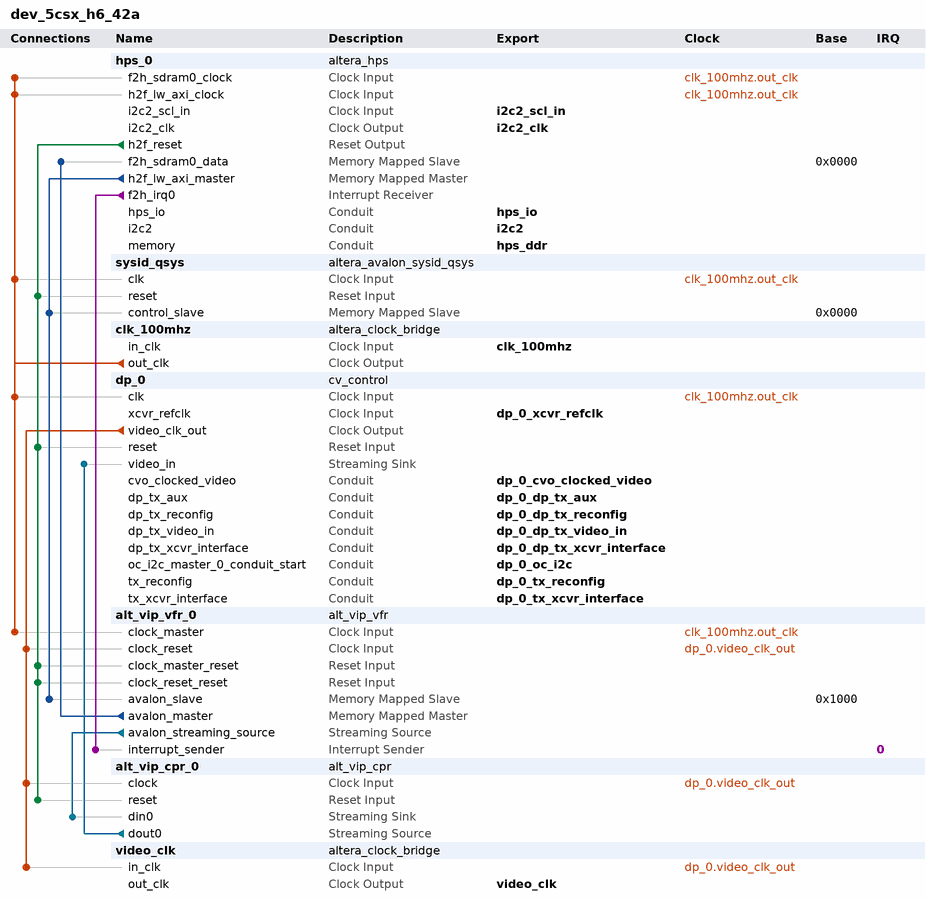
[diagram p0: system contents]
# Platform Designer (Qsys) system dev_5csx_h6_42a, Cyclone V 5CSXFC6C6U23C7
# Parameters at their usual value, and those the tool derives, are not listed.
package require -exact qsys 16.0
create_system dev_5csx_h6_42a
set_project_property DEVICE_FAMILY {Cyclone V}
set_project_property DEVICE 5CSXFC6C6U23C7

add_instance hps_0 altera_hps 16.0
set_instance_parameter_value hps_0 CAN0_Mode CAN
set_instance_parameter_value hps_0 CAN0_PinMuxing {HPS I/O Set 0}
set_instance_parameter_value hps_0 CAN1_Mode CAN
set_instance_parameter_value hps_0 CAN1_PinMuxing {HPS I/O Set 1}
set_instance_parameter_value hps_0 EMAC1_Mode RGMII
set_instance_parameter_value hps_0 EMAC1_PinMuxing {HPS I/O Set 0}
set_instance_parameter_value hps_0 F2SCLK_COLDRST_Enable false
set_instance_parameter_value hps_0 F2SCLK_DBGRST_Enable false
set_instance_parameter_value hps_0 F2SCLK_WARMRST_Enable false
set_instance_parameter_value hps_0 F2SDRAM_Type {Avalon-MM Read-Only}
set_instance_parameter_value hps_0 F2SDRAM_Width 256
set_instance_parameter_value hps_0 F2SINTERRUPT_Enable true
set_instance_parameter_value hps_0 F2S_Width 0
set_instance_parameter_value hps_0 FPGA_PERIPHERAL_OUTPUT_CLOCK_FREQ_EMAC0_GTX_CLK 100
set_instance_parameter_value hps_0 FPGA_PERIPHERAL_OUTPUT_CLOCK_FREQ_EMAC0_MD_CLK 100.0
set_instance_parameter_value hps_0 FPGA_PERIPHERAL_OUTPUT_CLOCK_FREQ_EMAC1_GTX_CLK 100
set_instance_parameter_value hps_0 FPGA_PERIPHERAL_OUTPUT_CLOCK_FREQ_EMAC1_MD_CLK 100.0
set_instance_parameter_value hps_0 HPS_PROTOCOL DDR3
set_instance_parameter_value hps_0 I2C0_Mode I2C
set_instance_parameter_value hps_0 I2C0_PinMuxing {HPS I/O Set 1}
set_instance_parameter_value hps_0 I2C1_Mode I2C
set_instance_parameter_value hps_0 I2C1_PinMuxing {HPS I/O Set 0}
set_instance_parameter_value hps_0 I2C2_Mode Full
set_instance_parameter_value hps_0 I2C2_PinMuxing FPGA
set_instance_parameter_value hps_0 LWH2F_Enable true
set_instance_parameter_value hps_0 MEM_BANKADDR_WIDTH 3
set_instance_parameter_value hps_0 MEM_CLK_FREQ 400.0
set_instance_parameter_value hps_0 MEM_COL_ADDR_WIDTH 10
set_instance_parameter_value hps_0 MEM_DQ_WIDTH 40
set_instance_parameter_value hps_0 MEM_DRV_STR RZQ/7
set_instance_parameter_value hps_0 MEM_ROW_ADDR_WIDTH 15
set_instance_parameter_value hps_0 MEM_RTT_NOM RZQ/4
set_instance_parameter_value hps_0 MEM_RTT_WR {Dynamic ODT off}
set_instance_parameter_value hps_0 MEM_TCL 7
set_instance_parameter_value hps_0 MEM_TFAW_NS 30.0
set_instance_parameter_value hps_0 MEM_TRAS_NS 35.0
set_instance_parameter_value hps_0 MEM_TRCD_NS 13.75
set_instance_parameter_value hps_0 MEM_TRFC_NS 260.0
set_instance_parameter_value hps_0 MEM_TRP_NS 13.75
set_instance_parameter_value hps_0 MEM_TRRD_NS 10.0
set_instance_parameter_value hps_0 MEM_TRTP_NS 10.0
set_instance_parameter_value hps_0 MEM_VENDOR JEDEC
set_instance_parameter_value hps_0 MEM_VOLTAGE {1.35V DDR3L}
set_instance_parameter_value hps_0 MEM_WTCL 6
set_instance_parameter_value hps_0 QSPI_Mode {2 SS}
set_instance_parameter_value hps_0 QSPI_PinMuxing {HPS I/O Set 1}
set_instance_parameter_value hps_0 REF_CLK_FREQ 25.0
set_instance_parameter_value hps_0 S2FCLK_USER2CLK 1
set_instance_parameter_value hps_0 S2F_Width 0
set_instance_parameter_value hps_0 SDIO_Mode {4-bit Data}
set_instance_parameter_value hps_0 SDIO_PinMuxing {HPS I/O Set 0}
set_instance_parameter_value hps_0 SPIM1_Mode N/A
set_instance_parameter_value hps_0 SPIM1_PinMuxing Unused
set_instance_parameter_value hps_0 STM_Enable false
set_instance_parameter_value hps_0 TIMING_BOARD_AC_SKEW 0.0
set_instance_parameter_value hps_0 TIMING_BOARD_AC_TO_CK_SKEW 0.0
set_instance_parameter_value hps_0 TIMING_BOARD_DQ_TO_DQS_SKEW 0.0
set_instance_parameter_value hps_0 TIMING_BOARD_MAX_CK_DELAY 0.6
set_instance_parameter_value hps_0 TIMING_BOARD_MAX_DQS_DELAY 0.2
set_instance_parameter_value hps_0 TIMING_BOARD_SKEW_BETWEEN_DQS 0.01
set_instance_parameter_value hps_0 TIMING_BOARD_SKEW_CKDQS_DIMM_MAX 0.215
set_instance_parameter_value hps_0 TIMING_BOARD_SKEW_CKDQS_DIMM_MIN 0.092
set_instance_parameter_value hps_0 TIMING_BOARD_SKEW_WITHIN_DQS 0.0
set_instance_parameter_value hps_0 TIMING_TDH 45
set_instance_parameter_value hps_0 TIMING_TDQSCK 225
set_instance_parameter_value hps_0 TIMING_TDQSQ 100
set_instance_parameter_value hps_0 TIMING_TDQSS 0.27
set_instance_parameter_value hps_0 TIMING_TDS 10
set_instance_parameter_value hps_0 TIMING_TDSH 0.18
set_instance_parameter_value hps_0 TIMING_TDSS 0.18
set_instance_parameter_value hps_0 TIMING_TIH 120
set_instance_parameter_value hps_0 TIMING_TIS 170
set_instance_parameter_value hps_0 TIMING_TQSH 0.4
set_instance_parameter_value hps_0 UART0_Mode {No Flow Control}
set_instance_parameter_value hps_0 UART0_PinMuxing {HPS I/O Set 2}
set_instance_parameter_value hps_0 USB1_Mode SDR
set_instance_parameter_value hps_0 USB1_PinMuxing {HPS I/O Set 0}
set_instance_parameter_value hps_0 desired_cfg_clk_mhz 100.0
set_instance_parameter_value hps_0 desired_qspi_clk_mhz 400.0

add_instance sysid_qsys altera_avalon_sysid_qsys 16.0
set_instance_parameter_value sysid_qsys id 1

add_instance clk_100mhz altera_clock_bridge 16.0
set_instance_parameter_value clk_100mhz DERIVED_CLOCK_RATE 0
set_instance_parameter_value clk_100mhz EXPLICIT_CLOCK_RATE 100000000

add_instance dp_0 cv_control 1.0

add_instance alt_vip_vfr_0 alt_vip_vfr 14.0
set_instance_parameter_value alt_vip_vfr_0 MAX_IMAGE_HEIGHT 1080
set_instance_parameter_value alt_vip_vfr_0 MAX_IMAGE_WIDTH 1920
set_instance_parameter_value alt_vip_vfr_0 MEM_PORT_WIDTH 256
set_instance_parameter_value alt_vip_vfr_0 RMASTER_FIFO_DEPTH 1024

add_instance alt_vip_cpr_0 alt_vip_cpr 13.1
set_instance_parameter_value alt_vip_cpr_0 DIN0_SYMBOLS_PER_BEAT 4
set_instance_parameter_value alt_vip_cpr_0 DIN1_ENABLED 0
set_instance_parameter_value alt_vip_cpr_0 DIN1_SYMBOLS_PER_BEAT 0
set_instance_parameter_value alt_vip_cpr_0 DOUT0_SYMBOLS_PER_BEAT 3
set_instance_parameter_value alt_vip_cpr_0 DOUT1_ENABLED 0
set_instance_parameter_value alt_vip_cpr_0 DOUT1_SYMBOLS_PER_BEAT 0
set_instance_parameter_value alt_vip_cpr_0 PARAMETERISATION {<colourPatternRearrangerParams><CPR_NAME>Color Plane Sequencer</CPR_NAME><CPR_BPS>8</CPR_BPS><CPR_PORTS><INPUT_PORT><NAME>din0</NAME><STREAMING_DESCRIPTOR>[a:b:c:unnamed]</STREAMING_DESCRIPTOR><ENABLED>true</ENABLED></INPUT_PORT><INPUT_PORT><NAME>din1</NAME><STREAMING_DESCRIPTOR>[Channel]</STREAMING_DESCRIPTOR><ENABLED>false</ENABLED></INPUT_PORT><OUTPUT_PORT><NAME>dout0</NAME><STREAMING_DESCRIPTOR>[a:b:c]</STREAMING_DESCRIPTOR><ENABLED>true</ENABLED><NON_IMAGE_PACKET_SOURCE>din0</NON_IMAGE_PACKET_SOURCE><HALVE_WIDTH>true</HALVE_WIDTH></OUTPUT_PORT><OUTPUT_PORT><NAME>dout1</NAME><STREAMING_DESCRIPTOR>[Channel]</STREAMING_DESCRIPTOR><ENABLED>false</ENABLED><NON_IMAGE_PACKET_SOURCE>din0</NON_IMAGE_PACKET_SOURCE><HALVE_WIDTH>false</HALVE_WIDTH></OUTPUT_PORT></CPR_PORTS><CPR_INPUT_2_PIXELS>false</CPR_INPUT_2_PIXELS></colourPatternRearrangerParams>}

add_instance video_clk altera_clock_bridge 16.0
set_instance_parameter_value video_clk DERIVED_CLOCK_RATE 139000000
set_instance_parameter_value video_clk EXPLICIT_CLOCK_RATE 0

# connections
add_connection clk_100mhz.out_clk alt_vip_vfr_0.clock_master clock
add_connection clk_100mhz.out_clk dp_0.clk clock
add_connection clk_100mhz.out_clk hps_0.f2h_sdram0_clock clock
add_connection clk_100mhz.out_clk hps_0.h2f_lw_axi_clock clock
add_connection clk_100mhz.out_clk sysid_qsys.clk clock
add_connection dp_0.video_clk_out alt_vip_cpr_0.clock clock
add_connection dp_0.video_clk_out alt_vip_vfr_0.clock_reset clock
add_connection dp_0.video_clk_out video_clk.in_clk clock
add_connection hps_0.h2f_reset alt_vip_cpr_0.reset reset
add_connection hps_0.h2f_reset alt_vip_vfr_0.clock_master_reset reset
add_connection hps_0.h2f_reset alt_vip_vfr_0.clock_reset_reset reset
add_connection hps_0.h2f_reset dp_0.reset reset
add_connection hps_0.h2f_reset sysid_qsys.reset reset
add_connection alt_vip_vfr_0.avalon_master hps_0.f2h_sdram0_data avalon
set_connection_parameter_value alt_vip_vfr_0.avalon_master/hps_0.f2h_sdram0_data baseAddress 0x0000
add_connection hps_0.h2f_lw_axi_master alt_vip_vfr_0.avalon_slave avalon
set_connection_parameter_value hps_0.h2f_lw_axi_master/alt_vip_vfr_0.avalon_slave baseAddress 0x1000
add_connection hps_0.h2f_lw_axi_master sysid_qsys.control_slave avalon
set_connection_parameter_value hps_0.h2f_lw_axi_master/sysid_qsys.control_slave baseAddress 0x0000
add_connection alt_vip_cpr_0.dout0 dp_0.video_in avalon_streaming
add_connection alt_vip_vfr_0.avalon_streaming_source alt_vip_cpr_0.din0 avalon_streaming
add_connection hps_0.f2h_irq0 alt_vip_vfr_0.interrupt_sender interrupt
set_connection_parameter_value hps_0.f2h_irq0/alt_vip_vfr_0.interrupt_sender irqNumber 0

# exported interfaces
add_interface clk_100mhz clock sink
set_interface_property clk_100mhz EXPORT_OF clk_100mhz.in_clk
add_interface dp_0_cvo_clocked_video conduit end
set_interface_property dp_0_cvo_clocked_video EXPORT_OF dp_0.cvo_clocked_video
add_interface dp_0_dp_tx_aux conduit end
set_interface_property dp_0_dp_tx_aux EXPORT_OF dp_0.dp_tx_aux
add_interface dp_0_dp_tx_reconfig conduit end
set_interface_property dp_0_dp_tx_reconfig EXPORT_OF dp_0.dp_tx_reconfig
add_interface dp_0_dp_tx_video_in conduit end
set_interface_property dp_0_dp_tx_video_in EXPORT_OF dp_0.dp_tx_video_in
add_interface dp_0_dp_tx_xcvr_interface conduit end
set_interface_property dp_0_dp_tx_xcvr_interface EXPORT_OF dp_0.dp_tx_xcvr_interface
add_interface dp_0_oc_i2c conduit end
set_interface_property dp_0_oc_i2c EXPORT_OF dp_0.oc_i2c_master_0_conduit_start
add_interface dp_0_tx_reconfig conduit end
set_interface_property dp_0_tx_reconfig EXPORT_OF dp_0.tx_reconfig
add_interface dp_0_tx_xcvr_interface conduit end
set_interface_property dp_0_tx_xcvr_interface EXPORT_OF dp_0.tx_xcvr_interface
add_interface dp_0_xcvr_refclk clock sink
set_interface_property dp_0_xcvr_refclk EXPORT_OF dp_0.xcvr_refclk
add_interface hps_ddr conduit end
set_interface_property hps_ddr EXPORT_OF hps_0.memory
add_interface hps_io conduit end
set_interface_property hps_io EXPORT_OF hps_0.hps_io
add_interface i2c2 conduit end
set_interface_property i2c2 EXPORT_OF hps_0.i2c2
add_interface i2c2_clk clock source
set_interface_property i2c2_clk EXPORT_OF hps_0.i2c2_clk
add_interface i2c2_scl_in clock sink
set_interface_property i2c2_scl_in EXPORT_OF hps_0.i2c2_scl_in
add_interface video_clk clock source
set_interface_property video_clk EXPORT_OF video_clk.out_clk

set_interconnect_requirement {$system} qsys_mm.clockCrossingAdapter HANDSHAKE
set_interconnect_requirement {$system} qsys_mm.maxAdditionalLatency 4

save_system dev_5csx_h6_42a.qsys
